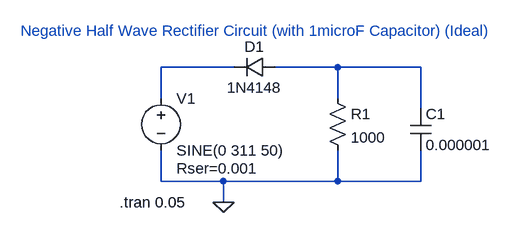
[diagram p0: schematic Assignment 3b (iii).asc]
Assignment 3b (iii).asc, the LTspice schematic file:
Version 4.1
SHEET 1 880 680
WIRE 320 64 208 64
WIRE 480 64 384 64
WIRE 608 64 480 64
WIRE 208 112 208 64
WIRE 480 112 480 64
WIRE 608 128 608 64
WIRE 208 240 208 192
WIRE 304 240 208 240
WIRE 480 240 480 192
WIRE 480 240 304 240
WIRE 608 240 608 192
WIRE 608 240 480 240
WIRE 304 272 304 240
FLAG 304 272 0
SYMBOL voltage 208 96 R0
WINDOW 123 0 0 Left 2
WINDOW 39 24 124 Left 2
SYMATTR SpiceLine Rser=0.001
SYMATTR InstName V1
SYMATTR Value SINE(0 311 50)
SYMBOL res 464 96 R0
SYMATTR InstName R1
SYMATTR Value 1000
SYMBOL diode 384 48 R90
WINDOW 0 0 32 VBottom 2
WINDOW 3 32 32 VTop 2
SYMATTR InstName D1
SYMATTR Value 1N4148
SYMBOL cap 592 128 R0
SYMATTR InstName C1
SYMATTR Value 0.000001
TEXT 144 272 Left 2 !.tran 0.05
TEXT -8 8 Left 2 ;Negative Half Wave Rectifier Circuit (with 1microF Capacitor) (Ideal)

The netlist it stands for:
* Assignment 3b (iii).asc
V1 N001 0 SINE(0 311 50) Rser=0.001
R1 N002 0 1000
D1 N002 N001 1N4148
C1 N002 0 0.000001
.model D D
.lib standard.dio
.tran 0.05
* Negative Half Wave Rectifier Circuit (with 1microF Capacitor) (Ideal)
.backanno
.end